# Altium schematic sheet AC-DC_Box_AssemblyInstructions.SchDoc
size Letter; DocumentNumber: 1; SheetNumber: 1; SheetTotal: 9
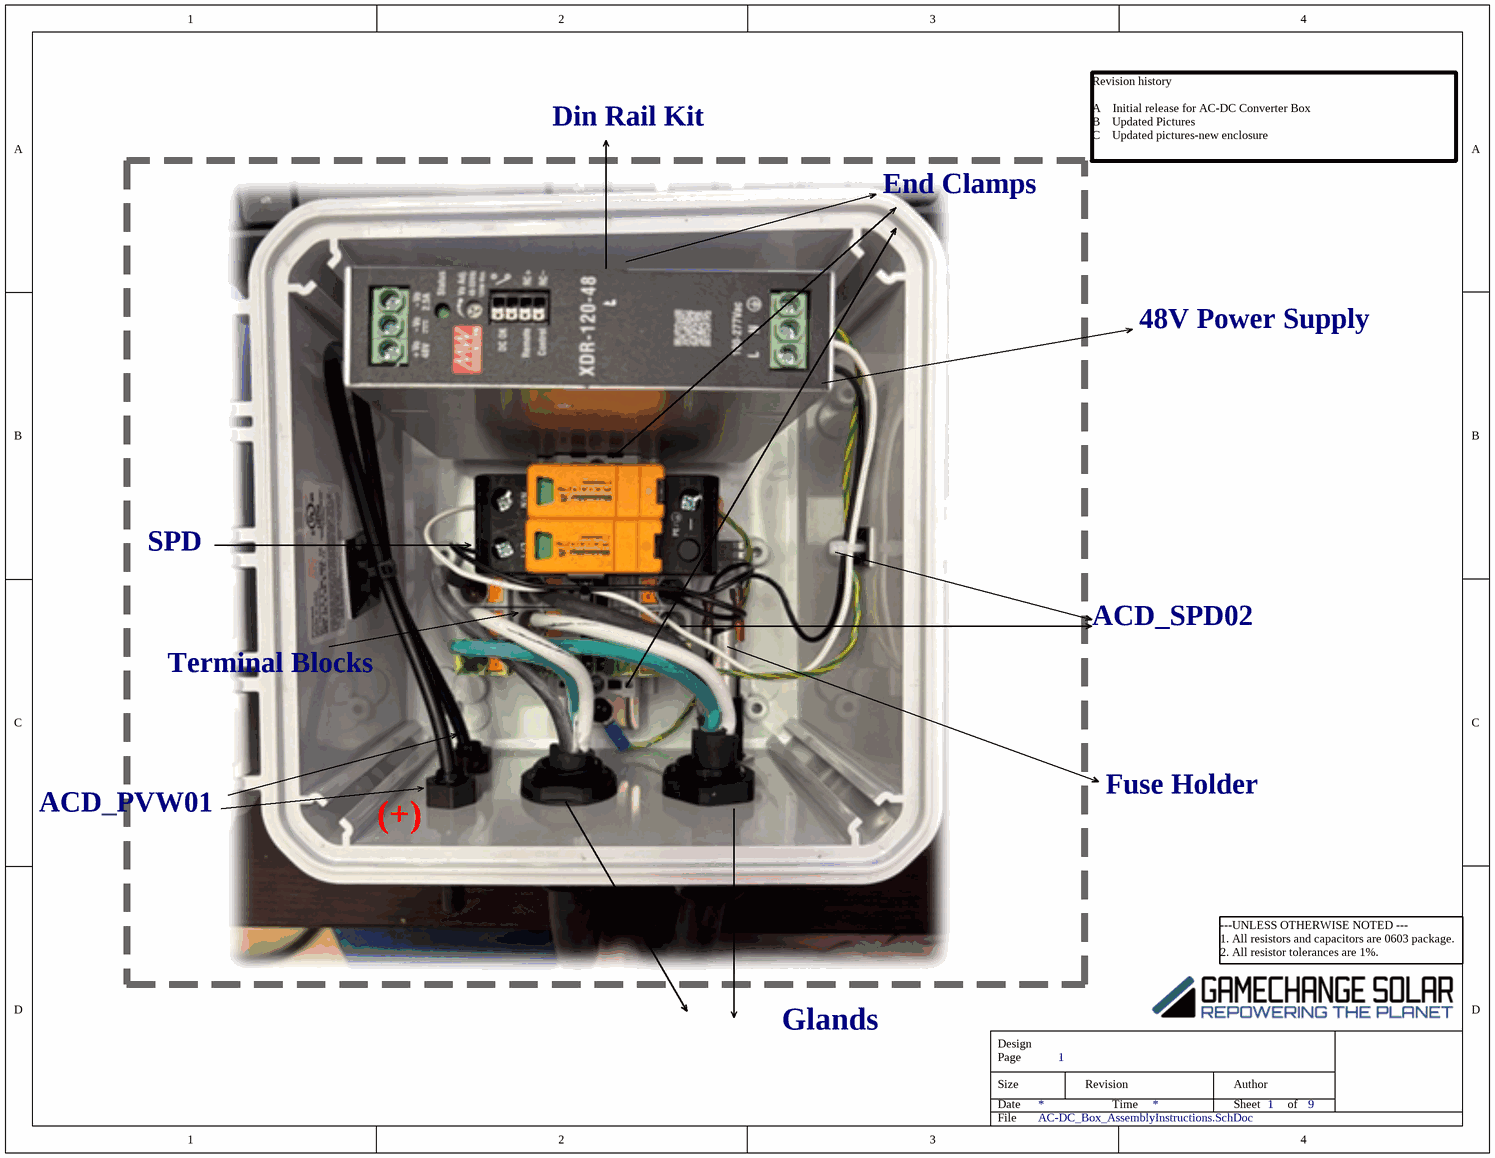
[diagram p0: AC-DC_Box_AssemblyInstructions.SchDoc]

## Notes on the sheet
- Din Rail Kit
- Revision history
  A    Initial release for AC-DC Converter Box
  B    Updated Pictures
  C    Updated pictures-new enclosure
- End Clamps
- 48V Power Supply
- SPD
- ACD_SPD02
- Terminal Blocks
- ACD_PVW01
- (+)
- Fuse Holder
- Glands
- ---UNLESS OTHERWISE NOTED ---
  1. All resistors and capacitors are 0603 package.
  2. All resistor tolerances are 1%.
- Design
- Size
- Date
- Page
- Revision
- Time
- Sheet
- Author
- of
- File